# Altium schematic sheet PowerRegulationBoard.SchDoc
size A
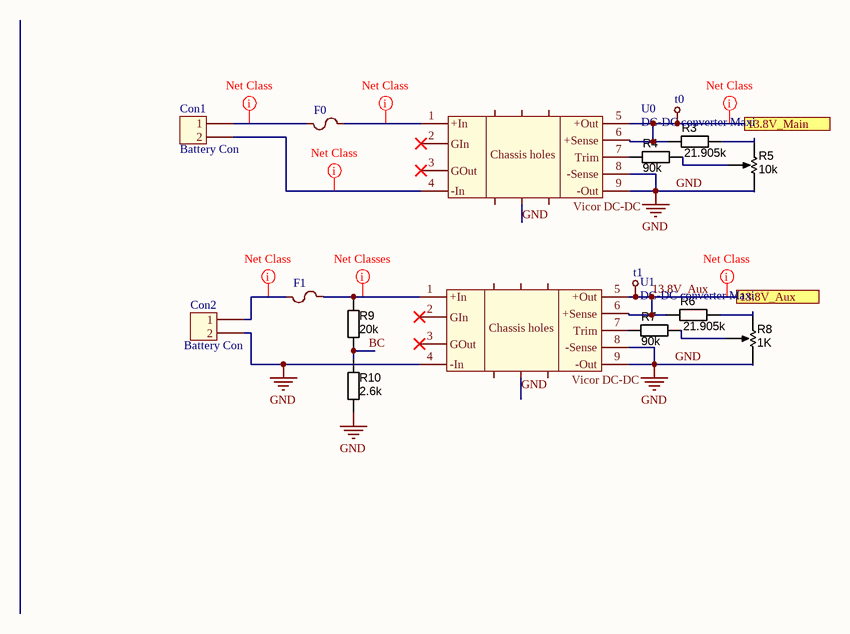
[diagram p0: PowerRegulationBoard.SchDoc]

## Parts
Con1  Battery Con  [Battery Con]
Con2  Battery Con  [Battery Con]
F0  PC TRON Fuse 5A  [PC TRON 5A]  (value not drawn)
F1  10A/32VDC Fuse holder  [10A/32V Fuse]  (value not drawn)
R3  value 21.905k  [RESC5025X70N]  (hidden comment: Thick Film)
R4  value 90k  [RESC5025X70N]  (hidden comment: Thick Film)
R5  value 10k  [TrimPot_THT_2.54mm pitch]  (hidden comment: 25 Turn)
R6  value 21.905k  [RESC5025X70N]  (hidden comment: Thick Film)
R7  value 90k  [RESC5025X70N]  (hidden comment: Thick Film)
R8  value 1K  [TrimPot_THT_2.54mm pitch]  (hidden comment: 25 Turn)
R9  value 20k  [RESC5025X70N]  (hidden comment: Thick Film)
R10  value 2.6k  [RESC5025X70N]  (hidden comment: Thick Film)
t0  Testpoint  [TestPoint]  (value not drawn)
t1  Testpoint  [TestPoint]  (value not drawn)
U0  DC-DC converter Maxi  [Vicor DC-DC Maxi]
U1  DC-DC converter Maxi  [Vicor DC-DC Maxi]

## Ports
13.8V_Aux, 13.8V_Main

## Nets
GND: Con2.2 R5.3(CW) R8.3(CW) R10.1 U0.8(-Sense) U0.9(-Out) U0.12 U1.4(-In) U1.8(-Sense) U1.9(-Out) U1.12
13.8V_Aux: R6.2 t1.1 U1.5(+Out) U1.6(+Sense) ; port 13.8V_Aux
13.8V_Main: R3.2 t0.1 U0.5(+Out) U0.6(+Sense) ; port 13.8V_Main
BC: R9.1 R10.2
NetCon1_1: Con1.1 F0.1
NetCon1_2: Con1.2 U0.4(-In)
NetCon2_1: Con2.1 F1.1
NetF0_2: F0.2 U0.1(+In)
NetF1_2: F1.2 R9.2 U1.1(+In)
NetR3_1: R3.1 R5.1(CCW)
NetR4_1: R4.1 R5.2(TAP)
NetR4_2: R4.2 U0.7(Trim)
NetR6_1: R6.1 R8.1(CCW)
NetR7_1: R7.1 R8.2(TAP)
NetR7_2: R7.2 U1.7(Trim)

Not connected (* = marked no-connect by the designer): U0 2(GIn)* 3(GOut)* 11(10) 13 14 15; U1 2(GIn)* 3(GOut)* 11(10) 13 14 15

## Layout directives
net class PowerNets: 13.8V_Aux, 13.8V_Main, NetCon1_1, NetCon1_2, NetF0_2
net class 5V: NetCon2_1, NetF1_2

## Notes on the sheet
- (in symbol DC-DC converter Maxi) Chassis holes; Vicor DC-DC

## Library data of the parts
Con1 Con2 = Battery Con: Aux and Main battery connector
R3 R4 R6 R7 R9 R10 = RES_10R_2010_5%: Resistor SMD chip 10 Ohm 0.25W 5% 2010; Manufacturer 1: Vishay/Dale; Manufacturer Part Number 1: CRCW120610R0JNEA; Ratings: 1/4W; SCDType: undef; Package / Case: 2010; Supplier 1: Digi-Key; Supplier Part Number 1: 541-10ECT-ND; ComponentLink1URL: http://www.vishay.com/doc?20035; ComponentLink1Description: http://www.vishay.com/doc?20035; Tolerance: ±5%
R5 R8 = RES_TRIMMER_1K_25T_THT: Trimmer, 25-Turn, 1K cermet; Manufacturer 1: Murata Electronics North America; Manufacturer Part Number 1: PV36Y102C01B00; Tolerance: 10%; Ratings: 25 turn variable cermet; SCDType: spec; Supplier 1: Digi-Key; Supplier Part Number 1: 490-2912-ND